# Altium schematic sheet Motordrive.SchDoc
size A
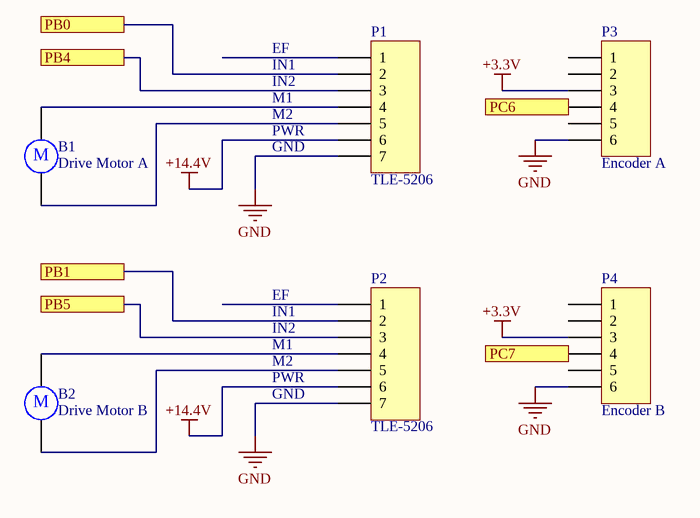
[diagram p0: Motordrive.SchDoc]

## Parts
B1  Drive Motor A  [RB5-10.5]
B2  Drive Motor B  [RB5-10.5]
P1  TLE-5206  [HDR1X7]
P2  TLE-5206  [HDR1X7]
P3  Encoder A  [HDR1X6]
P4  Encoder B  [HDR1X6]

## Ports
PB0, PB1, PB4, PB5, PC6, PC7

## Nets
+3.3V: P3.3 P4.3
+14.4V: P1.6 P2.6
GND: P1.7 P2.7 P3.6 P4.6
PB0: P1.2 ; port PB0
PB1: P2.2 ; port PB1
PB4: P1.3 ; port PB4
PB5: P2.3 ; port PB5
PC6: P3.4 ; port PC6
PC7: P4.4 ; port PC7
NetB1_1: B1.1 P1.4
NetB1_2: B1.2 P1.5
NetB2_1: B2.1 P2.4
NetB2_2: B2.2 P2.5

Not connected (* = marked no-connect by the designer): P1 1; P2 1; P3 1 2 5; P4 1 2 5

## Notes on the sheet
- EF
- IN1
- IN2
- M1
- M2
- PWR
- GND
- (in symbol Motor) M

## Library data of the parts
B1 B2 = Motor: Motor, General Kind; Manufacturer: Generic Components; Published: 1999
P1 P2 = Header 7: Header, 7-Pin; LatestRevisionDate: 17-Jul-2002; LatestRevisionNote: Re-released for DXP Platform.; Publisher: Altium Limited
P3 P4 = Header 6: Header, 6-Pin; LatestRevisionDate: 17-Jul-2002; LatestRevisionNote: Re-released for DXP Platform.; Publisher: Altium Limited